# Altium schematic sheet ALLPRINT-CAPBOARD-677512-STEP-MOTOR-DRIVER.SchDoc
size A3; Organization: Altium Limited; Address1: 3 Minna Close; Address2: Belrose; Address3: NSW 2085; Address4: Australia; DocumentNumber: 11; SheetNumber: 9; SheetTotal: 11
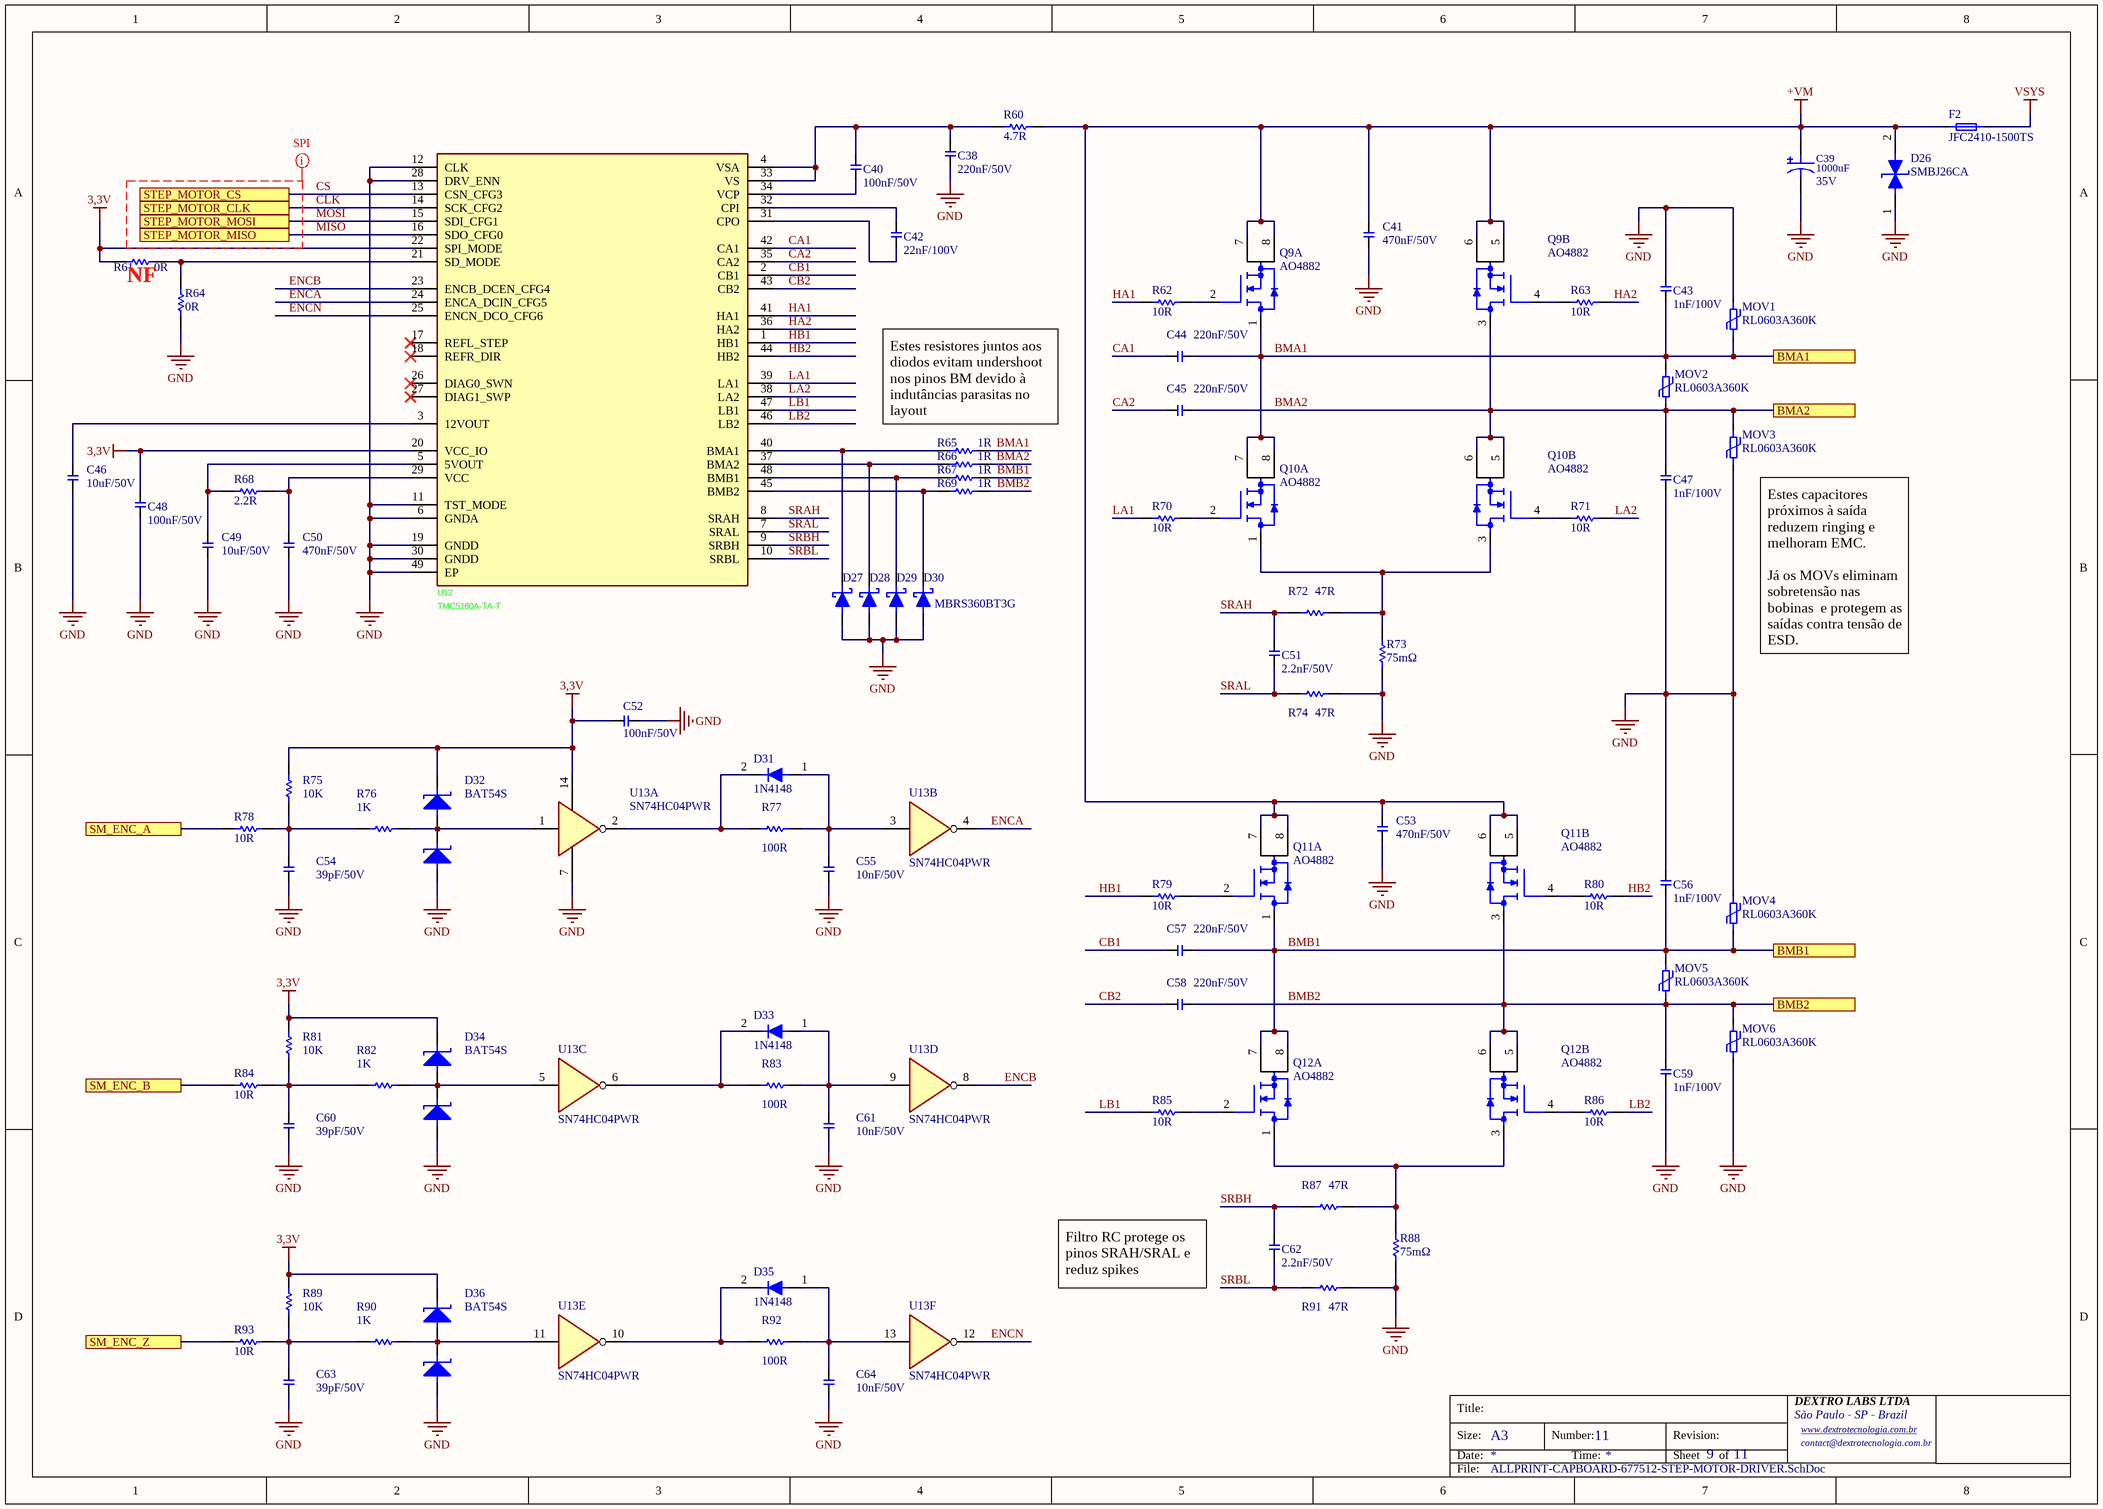
[diagram p0: ALLPRINT-CAPBOARD-677512-STEP-MOTOR-DRIVER.SchDoc]

## Parts
C38  220nF/50V  [CAP-0603]
C39  1000uF  VR: 35V  [CAP-ELET-D10-H20]
C40  100nF/50V  [CAP-0603]
C41  470nF/50V  [CAP-0603]
C42  22nF/100V  [CAP-0805]
C43  1nF/100V  [CAP-0805]
C44  220nF/50V  [CAP-0603]
C45  220nF/50V  [CAP-0603]
C46  10uF/50V  [CAP-0805]
C47  1nF/100V  [CAP-0805]
C48  100nF/50V  [CAP-0603]
C49  10uF/50V  [CAP-0805]
C50  470nF/50V  [CAP-0603]
C51  2.2nF/50V  [CAP-0603]
C52  100nF/50V  [CAP-0603]
C53  470nF/50V  [CAP-0603]
C54  39pF/50V  [CAP-0603]
C55  10nF/50V  [CAP-0603]
C56  1nF/100V  [CAP-0805]
C57  220nF/50V  [CAP-0603]
C58  220nF/50V  [CAP-0603]
C59  1nF/100V  [CAP-0805]
C60  39pF/50V  [CAP-0603]
C61  10nF/50V  [CAP-0603]
C62  2.2nF/50V  [CAP-0603]
C63  39pF/50V  [CAP-0603]
C64  10nF/50V  [CAP-0603]
D26  SMBJ26CA  [DO214-AA]
D27  MBRS360BT3G  [SOD-123FL]  (value not drawn)
D28  MBRS360BT3G  [SOD-123FL]  (value not drawn)
D29  MBRS360BT3G  [SOD-123FL]  (value not drawn)
D30  MBRS360BT3G  [SOD-123FL]
D31  1N4148  [SOD123]
D32  BAT54S  [SOT23-3]
D33  1N4148  [SOD123]
D34  BAT54S  [SOT23-3]
D35  1N4148  [SOD123]
D36  BAT54S  [SOT23-3]
F2  JFC2410-1500TS  [FUSE-2410]
MOV1  RL0603A360K  [MOV-0603]
MOV2  RL0603A360K  [MOV-0603]
MOV3  RL0603A360K  [MOV-0603]
MOV4  RL0603A360K  [MOV-0603]
MOV5  RL0603A360K  [MOV-0603]
MOV6  RL0603A360K  [MOV-0603]
Q9  AO4882  [SOIC-08]  (parts A,B of 2)
Q10  AO4882  [SOIC-08]  (parts A,B of 2)
Q11  AO4882  [SOIC-08]  (parts A,B of 2)
Q12  AO4882  [SOIC-08]  (parts A,B of 2)
R60  4.7R  [RES-0805]
R61  0R  [RES-0603]
R62  10R  [RES-0603]
R63  10R  [RES-0603]
R64  0R  [RES-0603]
R65  1R  [RES-0603]
R66  1R  [RES-0603]
R67  1R  [RES-0603]
R68  2.2R  [RES-0603]
R69  1R  [RES-0603]
R70  10R  [RES-0603]
R71  10R  [RES-0603]
R72  47R  [RES-0603]
R73  75mΩ  [RES-2512]
R74  47R  [RES-0603]
R75  10K  [RES-0805]
R76  1K  [RES-0603]
R77  100R  [RES-0603]
R78  10R  [RES-0603]
R79  10R  [RES-0603]
R80  10R  [RES-0603]
R81  10K  [RES-0805]
R82  1K  [RES-0603]
R83  100R  [RES-0603]
R84  10R  [RES-0603]
R85  10R  [RES-0603]
R86  10R  [RES-0603]
R87  47R  [RES-0603]
R88  75mΩ  [RES-2512]
R89  10K  [RES-0805]
R90  1K  [RES-0603]
R91  47R  [RES-0603]
R92  100R  [RES-0603]
R93  10R  [RES-0603]
U12  TMC5160A-TA-T  [TQFP-48_L7.0-W7.0-P0.50-LS9.0-BL-EP]
U13  SN74HC04PWR  [TSSOP-14]  (parts A,B,C,D,E,F of 6)

## Ports
BMA1 (see ALLPRINT-CAPBOARD-677512-GENERAL[4D]), BMA2 (see ALLPRINT-CAPBOARD-677512-GENERAL[4D]), BMB1 (see ALLPRINT-CAPBOARD-677512-GENERAL[4D]), BMB2 (see ALLPRINT-CAPBOARD-677512-GENERAL[4D]), SM_ENC_A (see ALLPRINT-CAPBOARD-677512-GENERAL[4D]), SM_ENC_B (see ALLPRINT-CAPBOARD-677512-GENERAL[4D]), SM_ENC_Z (see ALLPRINT-CAPBOARD-677512-GENERAL[4D]), STEP_MOTOR_CLK (see ALLPRINT-CAPBOARD-677512-GENERAL[3D], ALLPRINT-CAPBOARD-677512-MCU[5B]), STEP_MOTOR_CS (see ALLPRINT-CAPBOARD-677512-GENERAL[3D], ALLPRINT-CAPBOARD-677512-MCU[5B]), STEP_MOTOR_MISO (see ALLPRINT-CAPBOARD-677512-GENERAL[3D], ALLPRINT-CAPBOARD-677512-MCU[5B]), STEP_MOTOR_MOSI (see ALLPRINT-CAPBOARD-677512-GENERAL[3D], ALLPRINT-CAPBOARD-677512-MCU[5B])

## Nets
3,3V: C48.2 C52.2 D32.2 D34.2 D36.2 R61.2 R75.2 R81.2 R89.2 U12.20(VCC_IO) U12.22(SPI_MODE) U13.14(VCC)
+VM: C39.1 C41.2 C53.2 D26.2(A2) F2.1 Q9.5(D) Q9.6(D) Q9.7(D) Q9.8(D) Q11.5(D) Q11.6(D) Q11.7(D) Q11.8(D) R60.2
GND: C38.1 C39.2 C41.1 C43.2 C46.1 C47.1 C48.1 C49.1 C50.1 C52.1 C53.1 C54.1 C55.1 C56.2 C59.1 C60.1 C61.1 C63.1 C64.1 D26.1(A1) D27.1(A) D28.1(A) D29.1(A) D30.1(A) D32.1 D34.1 D36.1 MOV1.2 MOV3.1 MOV4.2 MOV6.1 R64.1 R73.1 R74.2 R88.1 R91.2 U12.6(GNDA) U12.11(TST_MODE) U12.12(CLK) U12.19(GNDD) U12.28(DRV_ENN) U12.30(GNDD) U12.49(EP) U13.7(GND)
VSYS: F2.2
BMA1: C43.1 C44.2 MOV1.1 MOV2.2 Q9.1(S) Q10.7(D) Q10.8(D) R65.2 ; port BMA1
BMA2: C45.2 C47.2 MOV2.1 MOV3.2 Q9.3(S) Q10.5(D) Q10.6(D) R66.2 ; port BMA2
BMB1: C56.1 C57.2 MOV4.1 MOV5.2 Q11.1(S) Q12.7(D) Q12.8(D) R67.2 ; port BMB1
BMB2: C58.2 C59.2 MOV5.1 MOV6.2 Q11.3(S) Q12.5(D) Q12.6(D) R69.2 ; port BMB2
CA1: C44.1 U12.42(CA1)
CA2: C45.1 U12.35(CA2)
CB1: C57.1 U12.2(CB1)
CB2: C58.1 U12.43(CB2)
CLK: U12.14(SCK_CFG2) ; port STEP_MOTOR_CLK
CS: U12.13(CSN_CFG3) ; port STEP_MOTOR_CS
ENCA: U12.24(ENCA_DCIN_CFG5) U13.4(4Y)
ENCB: U12.23(ENCB_DCEN_CFG4) U13.8
ENCN: U12.25(ENCN_DCO_CFG6) U13.12
HA1: R62.1 U12.41(HA1)
HA2: R63.2 U12.36(HA2)
HB1: R79.1 U12.1(HB1)
HB2: R80.2 U12.44(HB2)
LA1: R70.1 U12.39(LA1)
LA2: R71.2 U12.38(LA2)
LB1: R85.1 U12.47(LB1)
LB2: R86.2 U12.46(LB2)
MISO: U12.16(SDO_CFG0) ; port STEP_MOTOR_MISO
MOSI: U12.15(SDI_CFG1) ; port STEP_MOTOR_MOSI
SM_ENC_A: R78.1 ; port SM_ENC_A
SM_ENC_B: R84.1 ; port SM_ENC_B
SM_ENC_Z: R93.1 ; port SM_ENC_Z
SRAH: C51.2 R72.1 U12.8(SRAH)
SRAL: C51.1 R74.1 U12.7(SRAL)
SRBH: C62.2 R87.1 U12.9(SRBH)
SRBL: C62.1 R91.1 U12.10(SRBL)
NetC38_2: C38.2 C40.2 R60.1 U12.4(VSA) U12.33(VS)
NetC40_1: C40.1 U12.34(VCP)
NetC42_1: C42.1 U12.31(CPO)
NetC42_2: C42.2 U12.32(CPI)
NetC46_2: C46.2 U12.3(12VOUT)
NetC49_2: C49.2 R68.1 U12.5(5VOUT)
NetC50_2: C50.2 R68.2 U12.29(VCC)
NetC54_2: C54.2 R75.1 R76.1 R78.2
NetC55_2: C55.2 D31.1(A1) R77.2 U13.3(4A)
NetC60_2: C60.2 R81.1 R82.1 R84.2
NetC61_2: C61.2 D33.1(A1) R83.2 U13.9
NetC63_2: C63.2 R89.1 R90.1 R93.2
NetC64_2: C64.2 D35.1(A1) R92.2 U13.13
NetD27_2: D27.2(K) R65.1 U12.40(BMA1)
NetD28_2: D28.2(K) R66.1 U12.37(BMA2)
NetD29_2: D29.2(K) R67.1 U12.48(BMB1)
NetD30_2: D30.2(K) R69.1 U12.45(BMB2)
NetD31_2: D31.2(K) R77.1 U13.2
NetD32_3: D32.3 R76.2 U13.1(1A)
NetD33_2: D33.2(K) R83.1 U13.6
NetD34_3: D34.3 R82.2 U13.5
NetD35_2: D35.2(K) R92.1 U13.10
NetD36_3: D36.3 R90.2 U13.11
NetQ9_2: Q9.2(G) R62.2
NetQ9_4: Q9.4(G) R63.1
NetQ10_1: Q10.1(S) Q10.3(S) R72.2 R73.2
NetQ10_2: Q10.2(G) R70.2
NetQ10_4: Q10.4(G) R71.1
NetQ11_2: Q11.2(G) R79.2
NetQ11_4: Q11.4(G) R80.1
NetQ12_1: Q12.1(S) Q12.3(S) R87.2 R88.2
NetQ12_2: Q12.2(G) R85.2
NetQ12_4: Q12.4(G) R86.1
NetR61_1: R61.1 R64.2 U12.21(SD_MODE)

Not connected (* = marked no-connect by the designer): U12 17(REFL_STEP)* 18(REFR_DIR)* 26(DIAG0_SWN)* 27(DIAG1_SWP)*

## Layout directives
net class SPI: (no net found under the mark)

## Notes on the sheet
- (near R61) NF
- Estes resistores juntos aos diodos evitam undershoot nos pinos BM devido à indutâncias parasitas no layout
- (near MOV3) Estes capacitores próximos à saída reduzem ringing e melhoram EMC.
  Já os MOVs eliminam sobretensão nas bobinas  e protegem as saídas contra tensão de ESD.
- Filtro RC protege os pinos SRAH/SRAL e reduz spikes
- Title:
- Size:
- Date:
- A3
- Number:
- Time:
- Revision:
- Sheet
- of
- DEXTRO LABS LTDA
- São Paulo - SP - Brazil
- www.dextrotecnologia.com.br <http://www.dextrotecnologia.com.br>
- contact@dextrotecnologia.com.br
- File:

## Library data of the parts
C38 C44 C45 C57 C58 = CAP-220nF/50V-0603-X7R-MLCC: 50V 220nF X7R ±10% 0603 Multilayer Ceramic Capacitors MLCC - SMD/SMT ROHS; LCSC: C64705
C39 = CAP-1000uF-35V-D10-H20: 1000uF 35V ±20% Through Hole,D10xL20mm Aluminum Electrolytic Capacitors RoHS; LCSC: C398835
C40 C48 C52 = CAP-100nF/50V-0603-X7R-MLCC: 50V 100nF X7R ±10% 0603 Multilayer Ceramic Capacitors MLCC - SMD/SMT ROHS; LCSC: C14663
C41 C50 C53 = CAP-470nF/50V-0603-X7R-MLCC: 50V 470nF X7R ±10% 0603 Multilayer Ceramic Capacitors MLCC - SMD/SMT ROHS; LCSC: C513577
C42 = CAP-22nF/100V-0805-X7R-MLCC: 100V 22nF X7R ±10% 0805 Ceramic Capacitors RoHS; LCSC: C107137
C43 C47 C56 C59 = CAP-1nF/100V-0805-NP0-MLCC: 100V 1nF NP0 ±5% 0805 Ceramic Capacitors RoHS; LCSC: C326940
C46 C49 = CAP-10uF/50V-0805-X5R-MLCC: 50V 10uF X5R ±10% 1206 Multilayer Ceramic Capacitors MLCC - SMD/SMT ROHS; LCSC: C13585
C51 C62 = CAP-2.2nF/50V-0603-X7R-MLCC: 50V 2.2nF X7R ±10% 0603 Ceramic Capacitors RoHS; LCSC: C107082
C54 C60 C63 = CAP-39pF/50V-0603-X7R-MLCC: 50V 39pF X7R ±10% 0603 Multilayer Ceramic Capacitors MLCC - SMD/SMT ROHS; LCSC: C107049
C55 C61 C64 = CAP-10nF/50V-0603-X7R-MLCC: 50V 10nF X7R ±10% 0603 Multilayer Ceramic Capacitors MLCC - SMD/SMT ROHS; LCSC: C1589
D26 = SMBJ26CA: 28.9V 26V 42.1V 14.2A 600W Bidirectional DO-214AA(SMB) TVS Diodes RoHS; LCSC: C908854
D27-D30 = DIODE-SCHOTTKY-60V-1A-DSK16: Independent 60V 700mV@1A 1A SOD-123FL Single Diodes RoHS; LCSC: C48676
D31 D33 D35 = 1N4148: 1A 4ns 75V Independent 1V@50mA 150mA SOD-123 Single Diodes RoHS; LCSC: C241939
D32 D34 D36 = BAT54S: 30V Dual 200mA 800mV@100mA SOT-23 Schottky Barrier Diodes (SBD) ROHS; LCSC: C916425
F2 = FUSE-250V-5A-2410: 250V Surface Mount Fuse 5A 2410 Fuses RoHS; LCSC: C136387
MOV1-MOV6 = MOV-RL0603A360K-SMD: 78V 28V 21V 33.6V~42V 0603 Varistors, MOVs RoHS; LCSC: C2935568
Q9-Q12 = AO4882: 40V 40A 2.4V 2 N-Channel SOIC-8 Single FETs, MOSFETs RoHS; LCSC: C477943
R60 = RES-4.7R-1%-125mW-0805: 125mW 4.7Ω 150V ±200ppm/℃ Thick Film Resistor ±1% 0805 Chip Resistor - Surface Mount RoHS; LCSC: C137513
R61 R64 = RES-0R-1%-100mW-0603: 100mW 0Ω 75V Thick Film Resistor ±5% 0603 Chip Resistor - Surface Mount RoHS; LCSC: C95177
R62 R63 R70 R71 R78-R80 R84-R86 R93 = RES-10R-1%-100mW-0603: 100mW Thick Film Resistor 75V ±1% ±400ppm/℃ 10Ω 0603 Chip Resistor - Surface Mount ROHS; LCSC: C22859
R65-R67 R69 = RES-1R-1%-100mW-0603: 1Ω 100mW 75V ±200ppm/℃ Thick Film Resistor ±5% 0603 Chip Resistor - Surface Mount RoHS; LCSC: C2907116
R68 = RES-2.2R-1%-100mW-0603: 2.2Ω 100mW 75V ±200ppm/℃ Thick Film Resistor ±5% 0603 Chip Resistor - Surface Mount RoHS; LCSC: C2930032
R72 R74 R87 R91 = RES-47R-1%-100mW-0603: 100mW Thick Film Resistor 75V ±100ppm/℃ ±1% 47Ω 0603 Chip Resistor - Surface Mount ROHS; LCSC: C114623
R73 R88 = RES-75mΩ-1%-3W-2512: 3W 75mΩ Current Sense Resistor ±50ppm/℃ ±1% 2512 Current Sense Resistors RoHS; LCSC: C49164914
R75 R81 R89 = RES-10K-1%-125mW-0805: 100mW Thick Film Resistor 75V ±100ppm/℃ ±1% 10K Chip Resistor - Surface Mount ROHS; LCSC: C84376
R76 R82 R90 = RES-1K-1%-100mW-0603: 100mW Thick Film Resistor 75V ±100ppm/℃ ±1% 1kΩ 0603 Chip Resistor - Surface Mount ROHS; LCSC: C22548
R77 R83 R92 = RES-100R-1%-100mW-0603: 100mW Thick Film Resistor 75V ±100ppm/℃ ±1% 100Ω 0603 Chip Resistor - Surface Mount ROHS; LCSC: C105588
U12 = TMC5160A-TA-T: Manufacturer: TRINAMIC; Add into BOM: yes; Interface: STEP/DIR；UART；SPI; Step Resolution: 256; Symbol: TMC5160A-TA-T; Device: TMC5160A-TA-T; Supplier Part: C516354; Manufacturer Part: TMC5160A-TA-T; Supplier Footprint: TQFP-48-EP(7x7); JLCPCB Part Class: Extended Part; Datasheet: https://item.szlcsc.com/datasheet/TMC5160A-TA-T/532372.html; Supplier: LCSC; Convert to PCB: yes; Technology: -; Voltage - Supply: -; Output Current: -; Operating Temperature: -40℃~+125℃; LCSC: C516354
U13 = SN74HC04PWR: 2V~6V 16ns@6V,50pF 2uA 6 1 TSSOP-14 Gates and Inverters RoHS; LCSC: C6810